# Altium schematic sheet LPCB218 - RS485 MUX CONTROL.SchDoc
size A3; Address1: Factory 10; Address2: 9-13 Dingley Avenue, Dandeong, VICTORIA 3175, AUSTRALIA; DocumentNumber: 8; Revision: 1; SheetNumber: 8; SheetTotal: 14; Lockie__PCB_SUB_ASSEMBLY: RS485 Mux.; Lockie__PCB_ASSEMBLY: Command Node; Lockie__LDL: LPCB218; Lockie__PCB_DESCRIPTION: Command Node
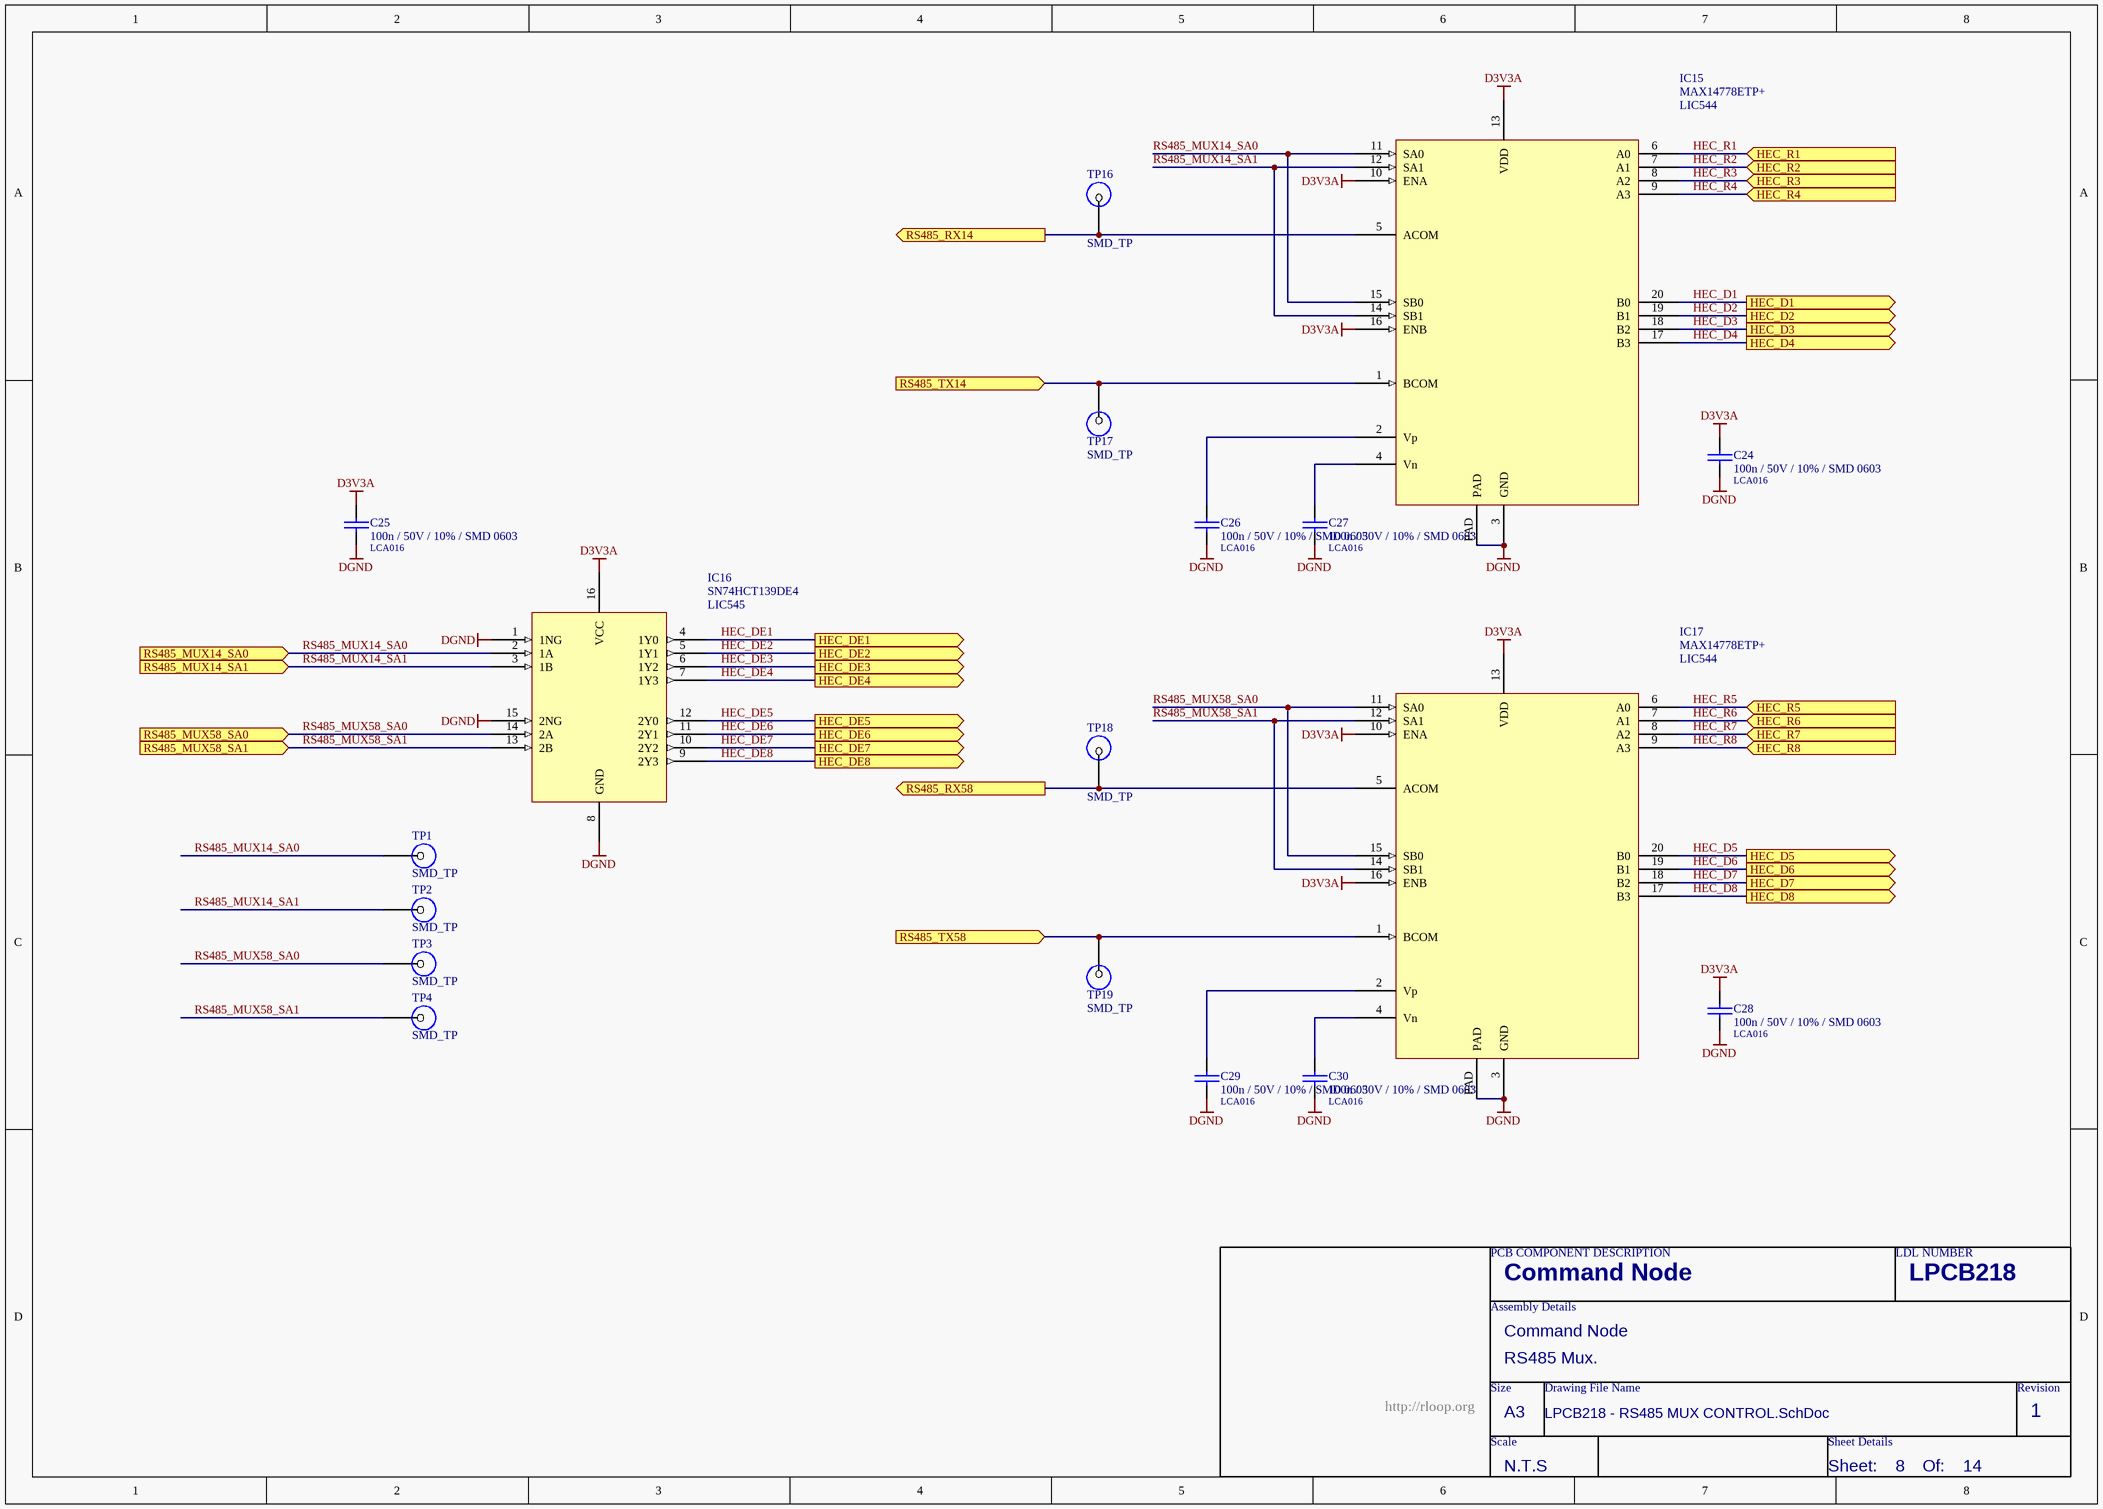
[diagram p0: LPCB218 - RS485 MUX CONTROL.SchDoc]

## Parts
C24  100n / 50V / 10% / SMD 0603  LDL_NUMBER: LCA016  [LFP011__CC1608-0603-IPC7351_B]
C25  100n / 50V / 10% / SMD 0603  LDL_NUMBER: LCA016  [LFP011__CC1608-0603-IPC7351_B]
C26  100n / 50V / 10% / SMD 0603  LDL_NUMBER: LCA016  [LFP011__CC1608-0603-IPC7351_B]
C27  100n / 50V / 10% / SMD 0603  LDL_NUMBER: LCA016  [LFP011__CC1608-0603-IPC7351_B]
C28  100n / 50V / 10% / SMD 0603  LDL_NUMBER: LCA016  [LFP011__CC1608-0603-IPC7351_B]
C29  100n / 50V / 10% / SMD 0603  LDL_NUMBER: LCA016  [LFP011__CC1608-0603-IPC7351_B]
C30  100n / 50V / 10% / SMD 0603  LDL_NUMBER: LCA016  [LFP011__CC1608-0603-IPC7351_B]
IC15  MAX14778ETP+  LDL_NUMBER: LIC544  [LFP014__QFN65P500X500X80_HS-21N]
IC16  SN74HCT139DE4  LDL_NUMBER: LIC545  [LFP079__SOP16]
IC17  MAX14778ETP+  LDL_NUMBER: LIC544  [LFP014__QFN65P500X500X80_HS-21N]
TP1  SMD_TP  [SMD-TP]  (no BOM)
TP2  SMD_TP  [SMD-TP]  (no BOM)
TP3  SMD_TP  [SMD-TP]  (no BOM)
TP4  SMD_TP  [SMD-TP]  (no BOM)
TP16  SMD_TP  [SMD-TP]  (no BOM)
TP17  SMD_TP  [SMD-TP]  (no BOM)
TP18  SMD_TP  [SMD-TP]  (no BOM)
TP19  SMD_TP  [SMD-TP]  (no BOM)

## Ports
HEC_D1 (out), HEC_D2 (out), HEC_D3 (out), HEC_D4 (out), HEC_D5 (out), HEC_D6 (out), HEC_D7 (out), HEC_D8 (out), HEC_DE1 (out), HEC_DE2 (out), HEC_DE3 (out), HEC_DE4 (out), HEC_DE5 (out), HEC_DE6 (out), HEC_DE7 (out), HEC_DE8 (out), HEC_R1 (in), HEC_R2 (in), HEC_R3 (in), HEC_R4 (in), HEC_R5 (in), HEC_R6 (in), HEC_R7 (in), HEC_R8 (in), RS485_MUX14_SA0 (in), RS485_MUX14_SA1 (in), RS485_MUX58_SA0 (in), RS485_MUX58_SA1 (in), RS485_RX14 (out), RS485_RX58 (out), RS485_TX14 (in), RS485_TX58 (in)

## Nets
D3V3A: C24.1 C25.1 C28.1 IC15.10(ENA) IC15.13(VDD) IC15.16(ENB) IC16.16(VCC) IC17.10(ENA) IC17.13(VDD) IC17.16(ENB)
DGND: C24.2 C25.2 C26.2 C27.2 C28.2 C29.2 C30.2 IC15.3(GND) IC15.PAD IC16.1(1NG) IC16.8(GND) IC16.15(2NG) IC17.3(GND) IC17.PAD
HEC_D1: IC15.20(B0) ; port HEC_D1
HEC_D2: IC15.19(B1) ; port HEC_D2
HEC_D3: IC15.18(B2) ; port HEC_D3
HEC_D4: IC15.17(B3) ; port HEC_D4
HEC_D5: IC17.20(B0) ; port HEC_D5
HEC_D6: IC17.19(B1) ; port HEC_D6
HEC_D7: IC17.18(B2) ; port HEC_D7
HEC_D8: IC17.17(B3) ; port HEC_D8
HEC_DE1: IC16.4(1Y0) ; port HEC_DE1
HEC_DE2: IC16.5(1Y1) ; port HEC_DE2
HEC_DE3: IC16.6(1Y2) ; port HEC_DE3
HEC_DE4: IC16.7(1Y3) ; port HEC_DE4
HEC_DE5: IC16.12(2Y0) ; port HEC_DE5
HEC_DE6: IC16.11(2Y1) ; port HEC_DE6
HEC_DE7: IC16.10(2Y2) ; port HEC_DE7
HEC_DE8: IC16.9(2Y3) ; port HEC_DE8
HEC_R1: IC15.6(A0) ; port HEC_R1
HEC_R2: IC15.7(A1) ; port HEC_R2
HEC_R3: IC15.8(A2) ; port HEC_R3
HEC_R4: IC15.9(A3) ; port HEC_R4
HEC_R5: IC17.6(A0) ; port HEC_R5
HEC_R6: IC17.7(A1) ; port HEC_R6
HEC_R7: IC17.8(A2) ; port HEC_R7
HEC_R8: IC17.9(A3) ; port HEC_R8
RS485_MUX14_SA0: IC15.11(SA0) IC15.15(SB0) IC16.2(1A) TP1.1 ; port RS485_MUX14_SA0
RS485_MUX14_SA1: IC15.12(SA1) IC15.14(SB1) IC16.3(1B) TP2.1 ; port RS485_MUX14_SA1
RS485_MUX58_SA0: IC16.14(2A) IC17.11(SA0) IC17.15(SB0) TP3.1 ; port RS485_MUX58_SA0
RS485_MUX58_SA1: IC16.13(2B) IC17.12(SA1) IC17.14(SB1) TP4.1 ; port RS485_MUX58_SA1
RS485_RX14: IC15.5(ACOM) TP16.1 ; port RS485_RX14
RS485_RX58: IC17.5(ACOM) TP18.1 ; port RS485_RX58
RS485_TX14: IC15.1(BCOM) TP17.1 ; port RS485_TX14
RS485_TX58: IC17.1(BCOM) TP19.1 ; port RS485_TX58
NetC26_1: C26.1 IC15.2(Vp)
NetC27_1: C27.1 IC15.4(Vn)
NetC29_1: C29.1 IC17.2(Vp)
NetC30_1: C30.1 IC17.4(Vn)

## Notes on the sheet
- PCB COMPONENT DESCRIPTION
- LDL NUMBER
- Assembly Details
- Size
- Drawing File Name
- Revision
- http://rloop.org
- Scale
- A3
- Sheet Details
- N.T.S
- Sheet:
- Of:

## Library data of the parts
C24-C30 = 100n / 50V / 10% / SMD 0603: Capacitor, Ceramic Chip, 100nF (0.1uF), 50V, 5%, SMD 0603 [LCA016]; FMEDA__OPERATING__VOLTAGE_MIN: 0; FMEDA__OPERATING__VOLTAGE_MAX: 3.3; FMEDA__OPERATING__TEMP_MIN: -20; FMEDA__OPERATING__TEMP_TYP: 27; FMEDA__OPERATING__TEMP_MAX: 50; FMEDA__CHANNEL: COM; Value: 100n; FMEDA__FUNCTION_IN_SYSTEM: *; FMEDA__OPERATING__VOLTAGE_TYP: 3.3
IC15 IC17 = MAX14778ETP+: IC, Mux 25V, SMD QFN20 [LIC544]
IC16 = SN74HCT139DE4: IC, Dual 2-4 Demux, SMD SOIC-16
TP1-TP4 TP16-TP19 = SMD_TP: SMD Test Point; FMEDA__CHANNEL: COM; FMEDA__OPERATING__CURRENT_MAX: 0; FMEDA__OPERATING__TEMP_MAX: 50; FMEDA__OPERATING__TEMP_MIN: -20; FMEDA__OPERATING__TEMP_TYP: 27; FMEDA__OPERATING__VOLTAGE_MAX: 16; FMEDA__OPERATING__VOLTAGE_TYP: 12; FMEDA__OPERATING__CURRENT_MIN: 0; FMEDA__OPERATING__CURRENT_TYP: 0; FMEDA__OPERATING__VOLTAGE_MIN: 0